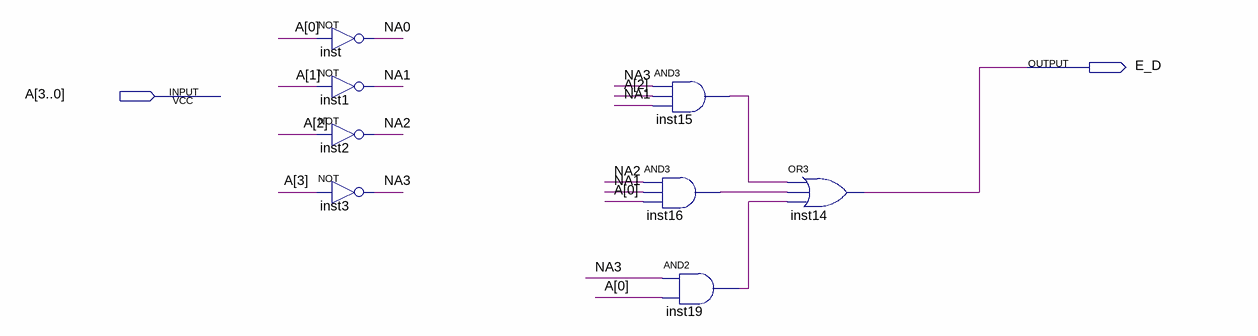
[diagram p0: schematic sheet]
// Quartus schematic Display_E.bdf as structural Verilog: 8 symbols, 2 pins
module Display_E (
  input  [3:0] A,
  output E_D
);

  wire inst15_out, inst16_out, inst19_out, NA0, NA1, NA2, NA3;

  not inst (NA0, A[0]);
  not inst1 (NA1, A[1]);
  not inst2 (NA2, A[2]);
  not inst3 (NA3, A[3]);
  and inst15 (inst15_out, NA3, A[2], NA1);
  and inst16 (inst16_out, NA2, NA1, A[0]);
  and inst19 (inst19_out, NA3, A[0]);
  or inst14 (E_D, inst15_out, inst16_out, inst19_out);
endmodule
